# EAGLE design SWITCHCONTROL (EAGLE 8.4.1)

## Sheet 1 of 4
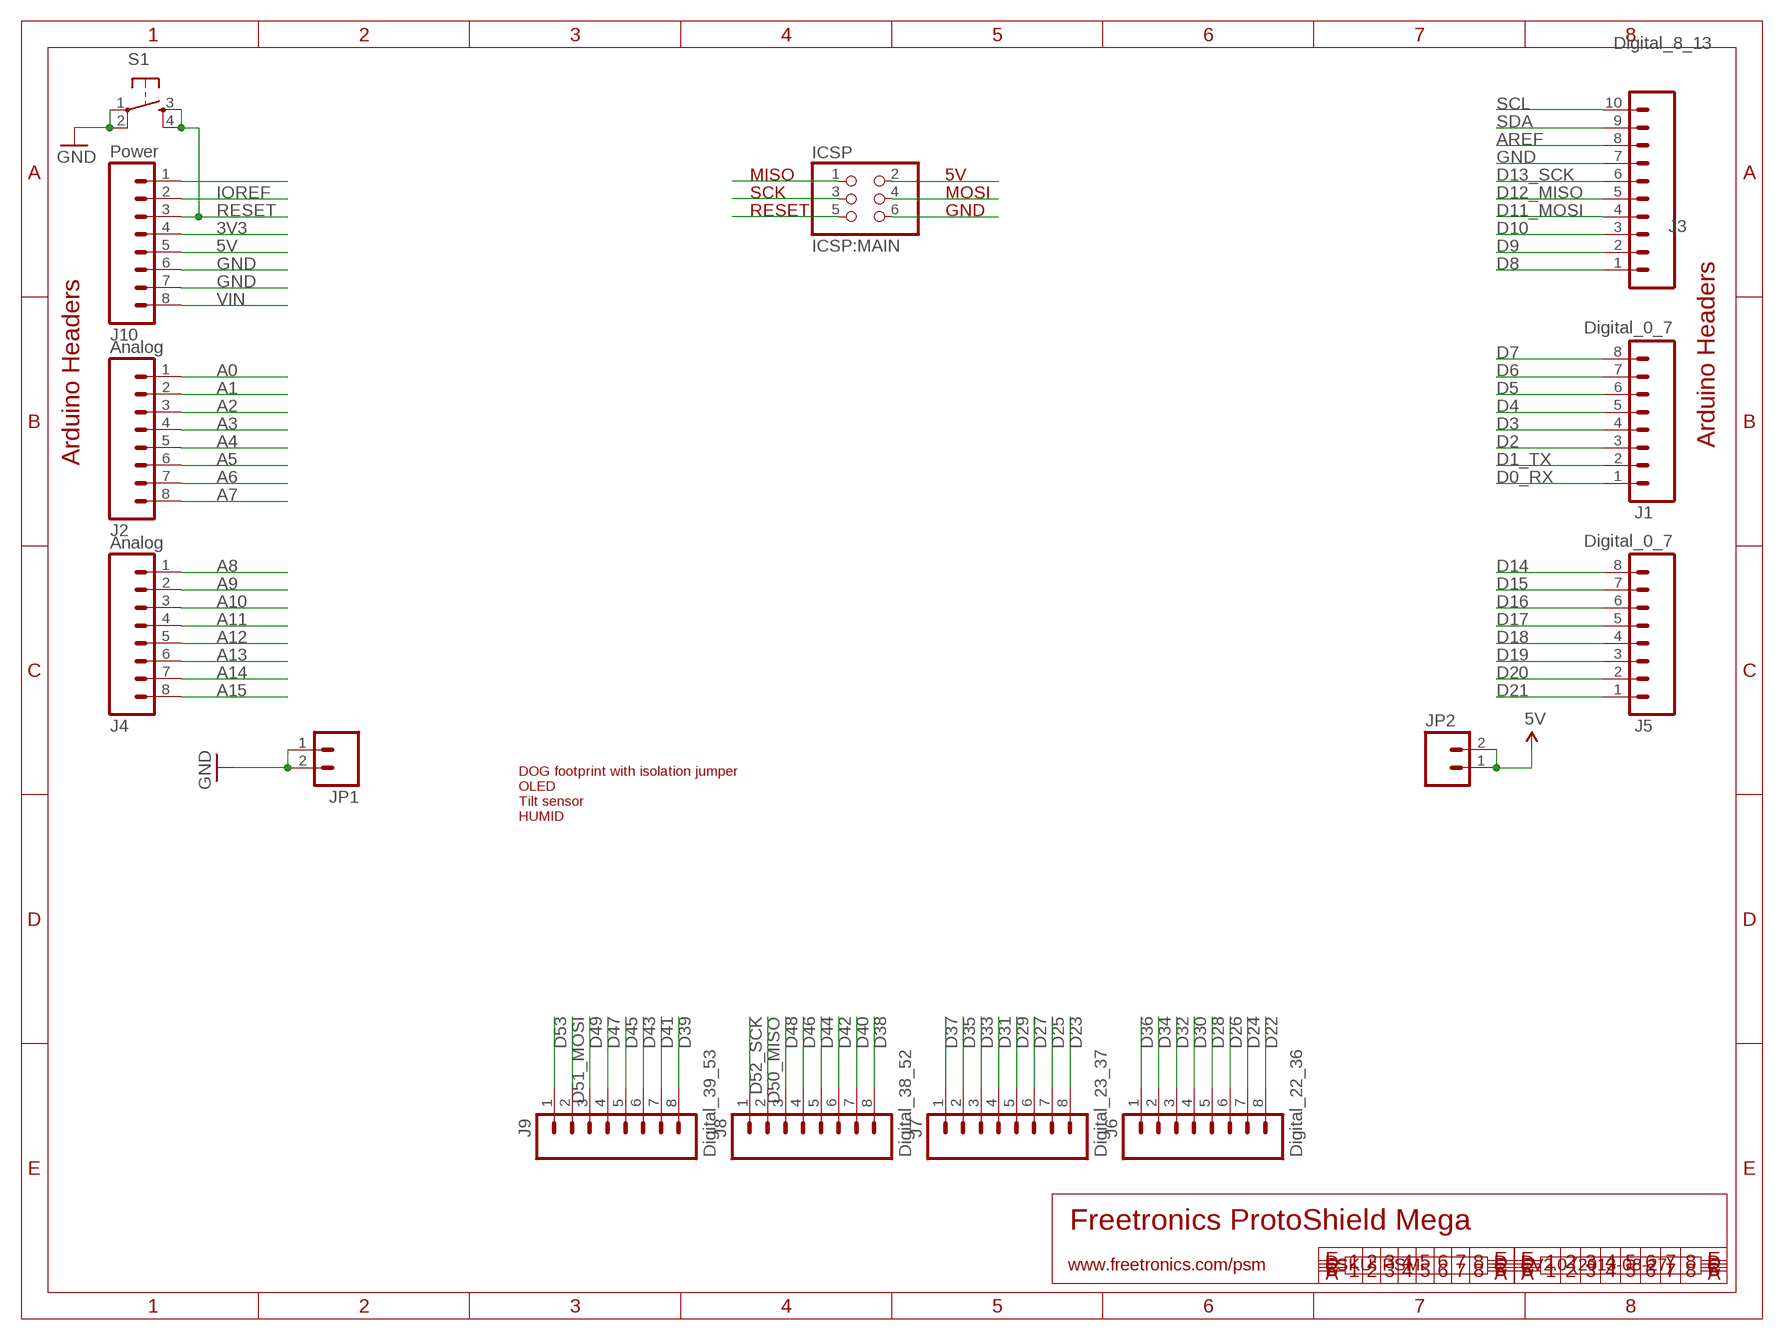
[diagram p0: schematic, sheet 1]

### Parts
ICSP  ICSP:MAIN  PINHD-2X3  [2X03]
J1  Digital_0_7  M08  [1X08]
J2  Analog  M08  [1X08]
J3  Digital_8_13  M100.1  [1X10]
J4  Analog  M08  [1X08]
J5  Digital_0_7  M08  [1X08]
J6  Digital_22_36  M08  [1X08]
J7  Digital_23_37  M08  [1X08]
J8  Digital_38_52  M08  [1X08]
J9  Digital_39_53  M08  [1X08]
J10  Power  M08  [1X08]
JP1  M02PTH  [1X02]
JP2  M02PTH  [1X02]
S1  TAC_SWITCHPTH  [TACTILE-PTH]

### Nets
3V3: J10.4
5V: J10.5 JP2.1 JP2.2
A0: J2.1 ; also sheet 2
A1: J2.2 ; also sheet 2
A2: J2.3 ; also sheet 2
A3: J2.4 ; also sheet 2
A4: J2.5 ; also sheet 2
A5: J2.6 ; also sheet 2
A6: J2.7 ; also sheet 2
A7: J2.8 ; also sheet 2
A8: J4.1 ; also sheet 2
A9: J4.2 ; also sheet 2
A10: J4.3 ; also sheet 2
A11: J4.4 ; also sheet 2
A12: J4.5 ; also sheet 2
A13: J4.6 ; also sheet 2
A14: J4.7 ; also sheet 2
A15: J4.8 ; also sheet 2
AREF: J3.8
D0_RX: J1.1
D1_TX: J1.2
D2: J1.3
D3: J1.4
D4: J1.5
D5: J1.6
D6: J1.7
D7: J1.8
D8: J3.1
D9: J3.2
D10: J3.3
D11_MOSI: J3.4
D12_MISO: J3.5
D13_SCK: J3.6
D14: J5.8
D15: J5.7
D16: J5.6 ; also sheet 3
D17: J5.5 ; also sheet 3
D18: J5.4 ; also sheet 3
D19: J5.3 ; also sheet 3
D20: J5.2 ; also sheet 3
D21: J5.1 ; also sheet 3
D22: J6.8 ; also sheet 3
D23: J7.8 ; also sheet 3
D24: J6.7 ; also sheet 4
D25: J7.7 ; also sheet 4
D26: J6.6 ; also sheet 4
D27: J7.6 ; also sheet 4
D28: J6.5 ; also sheet 4
D29: J7.5 ; also sheet 4
D30: J6.4 ; also sheet 4
D31: J7.4 ; also sheet 4
D32: J6.3 ; also sheet 4
D33: J7.3 ; also sheet 4
D34: J6.2 ; also sheet 4
D35: J7.2 ; also sheet 4
D36: J6.1 ; also sheet 4
D37: J7.1 ; also sheet 4
D38: J8.8 ; also sheet 4
D39: J9.8 ; also sheet 4
D40: J8.7 ; also sheet 3
D41: J9.7 ; also sheet 3
D42: J8.6 ; also sheet 3
D43: J9.6 ; also sheet 3
D44: J8.5 ; also sheet 3
D45: J9.5 ; also sheet 3
D46: J8.4 ; also sheet 3
D47: J9.4 ; also sheet 3
D48: J8.3
D49: J9.3
D50_MISO: J8.2
D51_MOSI: J9.2
D52_SCK: J8.1
D53: J9.1
GND: J3.7 J10.6 J10.7 JP1.1 JP1.2 S1.1 S1.2 ; also sheet 2,3,4
IOREF: J10.2
N$186: ICSP.1
N$187: ICSP.3
N$188: ICSP.5
N$197: ICSP.2
N$198: ICSP.4
N$199: ICSP.6
N$314: J10.1
RESET: J10.3 S1.3 S1.4
SCL: J3.10
SDA: J3.9
VIN: J10.8 ; also sheet 2,3,4

### Notes on the sheet
- MISO | 5V
- SCK | MOSI
- RESET | GND
- Arduino Headers
- Arduino Headers
- DOG footprint with isolation jumper
  OLED
  Tilt sensor
  HUMID
- Freetronics ProtoShield Mega
- www.freetronics.com/psm | SKU: PSM | V2.0 (2013-08-27)

## Sheet 2 of 4
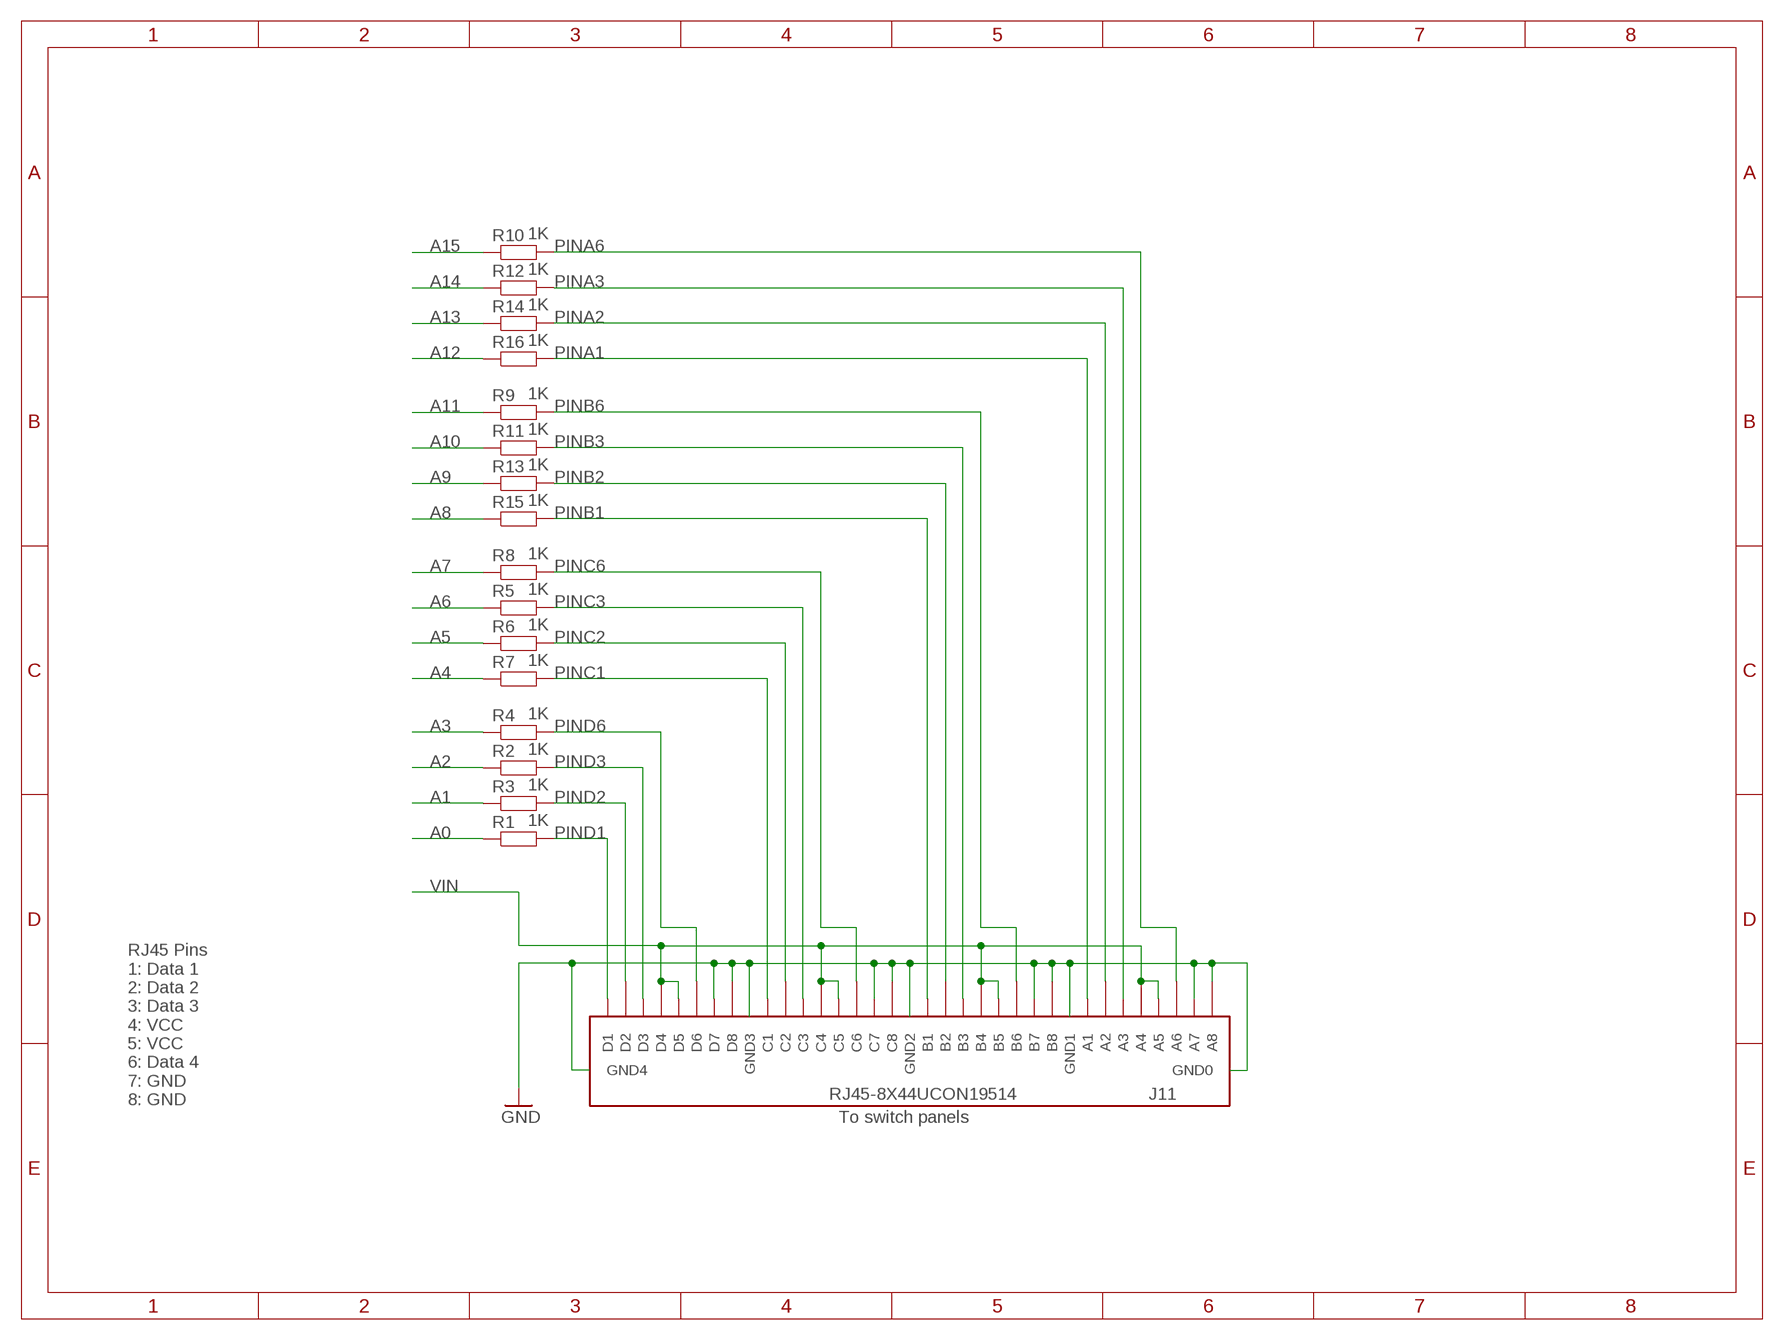
[diagram p1: schematic, sheet 2]

### Parts
J11  RJ45-8X44UCON19514  [RJ45-8X4]
R1  1K  RESISTOR0603  [0603]
R2  1K  RESISTOR0603  [0603]
R3  1K  RESISTOR0603  [0603]
R4  1K  RESISTOR0603  [0603]
R5  1K  RESISTOR0603  [0603]
R6  1K  RESISTOR0603  [0603]
R7  1K  RESISTOR0603  [0603]
R8  1K  RESISTOR0603  [0603]
R9  1K  RESISTOR0603  [0603]
R10  1K  RESISTOR0603  [0603]
R11  1K  RESISTOR0603  [0603]
R12  1K  RESISTOR0603  [0603]
R13  1K  RESISTOR0603  [0603]
R14  1K  RESISTOR0603  [0603]
R15  1K  RESISTOR0603  [0603]
R16  1K  RESISTOR0603  [0603]

### Nets
A0: R1.1 ; also sheet 1
A1: R3.1 ; also sheet 1
A2: R2.1 ; also sheet 1
A3: R4.1 ; also sheet 1
A4: R7.1 ; also sheet 1
A5: R6.1 ; also sheet 1
A6: R5.1 ; also sheet 1
A7: R8.1 ; also sheet 1
A8: R15.1 ; also sheet 1
A9: R13.1 ; also sheet 1
A10: R11.1 ; also sheet 1
A11: R9.1 ; also sheet 1
A12: R16.1 ; also sheet 1
A13: R14.1 ; also sheet 1
A14: R12.1 ; also sheet 1
A15: R10.1 ; also sheet 1
GND: J11.A7 J11.A8 J11.B7 J11.B8 J11.C7 J11.C8 J11.D7 J11.D8 J11.GND0 J11.GND1 J11.GND2 J11.GND3 J11.GND4 ; also sheet 1,3,4
PINA1: J11.A1 R16.2
PINA2: J11.A2 R14.2
PINA3: J11.A3 R12.2
PINA6: J11.A6 R10.2
PINB1: J11.B1 R15.2
PINB2: J11.B2 R13.2
PINB3: J11.B3 R11.2
PINB6: J11.B6 R9.2
PINC1: J11.C1 R7.2
PINC2: J11.C2 R6.2
PINC3: J11.C3 R5.2
PINC6: J11.C6 R8.2
PIND1: J11.D1 R1.2
PIND2: J11.D2 R3.2
PIND3: J11.D3 R2.2
PIND6: J11.D6 R4.2
VIN: J11.A4 J11.A5 J11.B4 J11.B5 J11.C4 J11.C5 J11.D4 J11.D5 ; also sheet 1,3,4

### Notes on the sheet
- RJ45 Pins
  1: Data 1
  2: Data 2
  3: Data 3
  4: VCC
  5: VCC
  6: Data 4
  7: GND
  8: GND
- To switch panels

## Sheet 3 of 4
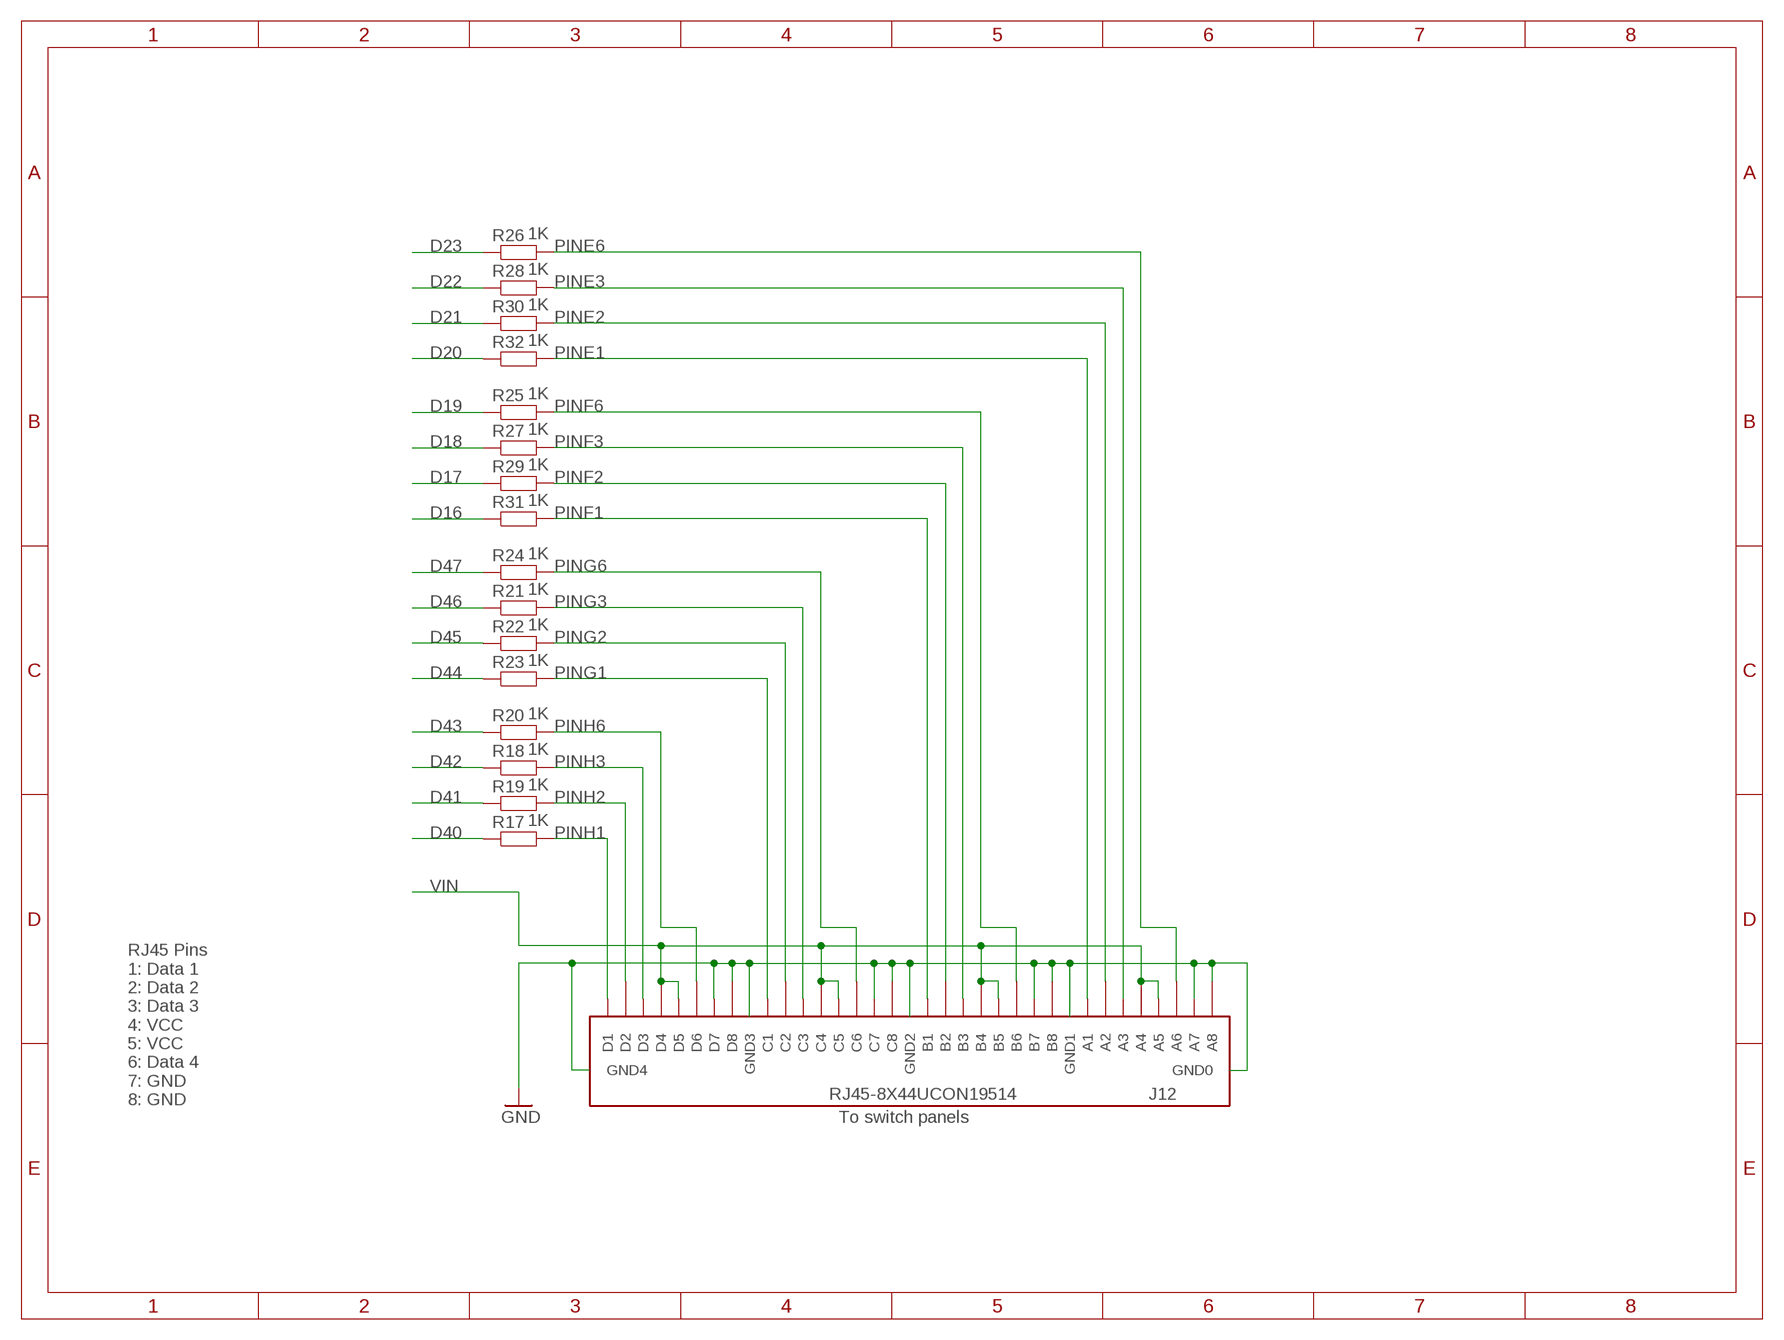
[diagram p2: schematic, sheet 3]

### Parts
J12  RJ45-8X44UCON19514  [RJ45-8X4]
R17  1K  RESISTOR0603  [0603]
R18  1K  RESISTOR0603  [0603]
R19  1K  RESISTOR0603  [0603]
R20  1K  RESISTOR0603  [0603]
R21  1K  RESISTOR0603  [0603]
R22  1K  RESISTOR0603  [0603]
R23  1K  RESISTOR0603  [0603]
R24  1K  RESISTOR0603  [0603]
R25  1K  RESISTOR0603  [0603]
R26  1K  RESISTOR0603  [0603]
R27  1K  RESISTOR0603  [0603]
R28  1K  RESISTOR0603  [0603]
R29  1K  RESISTOR0603  [0603]
R30  1K  RESISTOR0603  [0603]
R31  1K  RESISTOR0603  [0603]
R32  1K  RESISTOR0603  [0603]

### Nets
D16: R31.1 ; also sheet 1
D17: R29.1 ; also sheet 1
D18: R27.1 ; also sheet 1
D19: R25.1 ; also sheet 1
D20: R32.1 ; also sheet 1
D21: R30.1 ; also sheet 1
D22: R28.1 ; also sheet 1
D23: R26.1 ; also sheet 1
D40: R17.1 ; also sheet 1
D41: R19.1 ; also sheet 1
D42: R18.1 ; also sheet 1
D43: R20.1 ; also sheet 1
D44: R23.1 ; also sheet 1
D45: R22.1 ; also sheet 1
D46: R21.1 ; also sheet 1
D47: R24.1 ; also sheet 1
GND: J12.A7 J12.A8 J12.B7 J12.B8 J12.C7 J12.C8 J12.D7 J12.D8 J12.GND0 J12.GND1 J12.GND2 J12.GND3 J12.GND4 ; also sheet 1,2,4
PINE1: J12.A1 R32.2
PINE2: J12.A2 R30.2
PINE3: J12.A3 R28.2
PINE6: J12.A6 R26.2
PINF1: J12.B1 R31.2
PINF2: J12.B2 R29.2
PINF3: J12.B3 R27.2
PINF6: J12.B6 R25.2
PING1: J12.C1 R23.2
PING2: J12.C2 R22.2
PING3: J12.C3 R21.2
PING6: J12.C6 R24.2
PINH1: J12.D1 R17.2
PINH2: J12.D2 R19.2
PINH3: J12.D3 R18.2
PINH6: J12.D6 R20.2
VIN: J12.A4 J12.A5 J12.B4 J12.B5 J12.C4 J12.C5 J12.D4 J12.D5 ; also sheet 1,2,4

### Notes on the sheet
- RJ45 Pins
  1: Data 1
  2: Data 2
  3: Data 3
  4: VCC
  5: VCC
  6: Data 4
  7: GND
  8: GND
- To switch panels

## Sheet 4 of 4
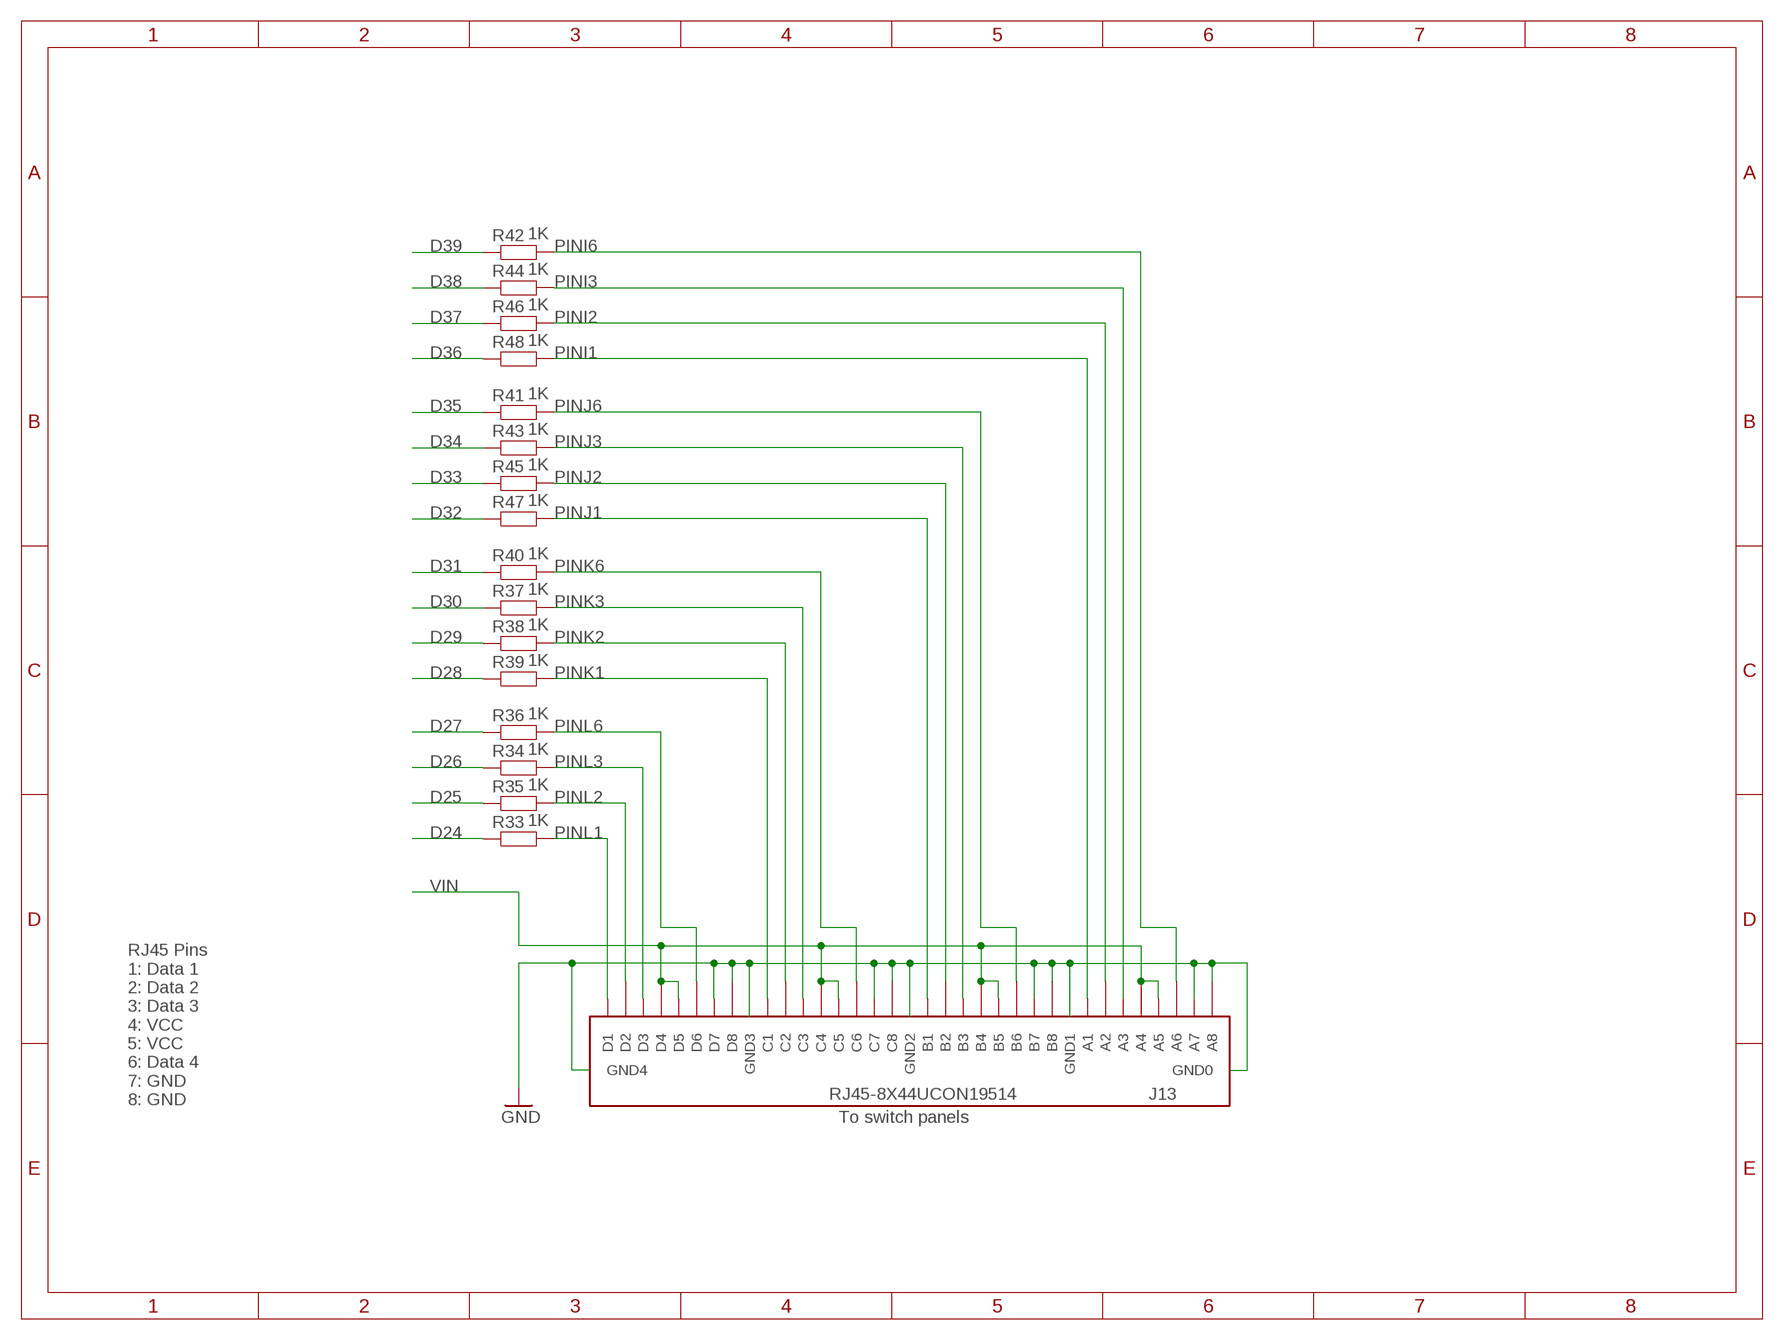
[diagram p3: schematic, sheet 4]

### Parts
J13  RJ45-8X44UCON19514  [RJ45-8X4]
R33  1K  RESISTOR0603  [0603]
R34  1K  RESISTOR0603  [0603]
R35  1K  RESISTOR0603  [0603]
R36  1K  RESISTOR0603  [0603]
R37  1K  RESISTOR0603  [0603]
R38  1K  RESISTOR0603  [0603]
R39  1K  RESISTOR0603  [0603]
R40  1K  RESISTOR0603  [0603]
R41  1K  RESISTOR0603  [0603]
R42  1K  RESISTOR0603  [0603]
R43  1K  RESISTOR0603  [0603]
R44  1K  RESISTOR0603  [0603]
R45  1K  RESISTOR0603  [0603]
R46  1K  RESISTOR0603  [0603]
R47  1K  RESISTOR0603  [0603]
R48  1K  RESISTOR0603  [0603]

### Nets
D24: R33.1 ; also sheet 1
D25: R35.1 ; also sheet 1
D26: R34.1 ; also sheet 1
D27: R36.1 ; also sheet 1
D28: R39.1 ; also sheet 1
D29: R38.1 ; also sheet 1
D30: R37.1 ; also sheet 1
D31: R40.1 ; also sheet 1
D32: R47.1 ; also sheet 1
D33: R45.1 ; also sheet 1
D34: R43.1 ; also sheet 1
D35: R41.1 ; also sheet 1
D36: R48.1 ; also sheet 1
D37: R46.1 ; also sheet 1
D38: R44.1 ; also sheet 1
D39: R42.1 ; also sheet 1
GND: J13.A7 J13.A8 J13.B7 J13.B8 J13.C7 J13.C8 J13.D7 J13.D8 J13.GND0 J13.GND1 J13.GND2 J13.GND3 J13.GND4 ; also sheet 1,2,3
PINI1: J13.A1 R48.2
PINI2: J13.A2 R46.2
PINI3: J13.A3 R44.2
PINI6: J13.A6 R42.2
PINJ1: J13.B1 R47.2
PINJ2: J13.B2 R45.2
PINJ3: J13.B3 R43.2
PINJ6: J13.B6 R41.2
PINK1: J13.C1 R39.2
PINK2: J13.C2 R38.2
PINK3: J13.C3 R37.2
PINK6: J13.C6 R40.2
PINL1: J13.D1 R33.2
PINL2: J13.D2 R35.2
PINL3: J13.D3 R34.2
PINL6: J13.D6 R36.2
VIN: J13.A4 J13.A5 J13.B4 J13.B5 J13.C4 J13.C5 J13.D4 J13.D5 ; also sheet 1,2,3

### Notes on the sheet
- RJ45 Pins
  1: Data 1
  2: Data 2
  3: Data 3
  4: VCC
  5: VCC
  6: Data 4
  7: GND
  8: GND
- To switch panels

## Library data of the parts
ICSP = pinhead:PINHD-2X3: PIN HEADER
J1 J5-J9 = freetronics:M08: Header 8 Standard 8-pin 0.1" header. Use with straight break away headers (SKU : PRT-00116), right angle break away headers (PRT-00553), swiss pins (PRT-00743), machine pins (PRT-00117), and female headers (PRT-00115).
J2 J4 J10 = freetronics-master-v1:M08: Header 8 Standard 8-pin 0.1" header. Use with straight break away headers (SKU : PRT-00116), right angle break away headers (PRT-00553), swiss pins (PRT-00743), machine pins (PRT-00117), and female headers (PRT-00115).
J3 = freetronics-original:M10: Header 10 Standard 10-pin 0.1" header. Use with straight break away headers (SKU : PRT-00116), right angle break away headers (PRT-00553), swiss pins (PRT-00743), machine pins (PRT-00117), and female headers (PRT-00115).
J11-J13 = freetronics-jon:RJ45-8X4
JP1 JP2 = freetronics-master-v1:M02: Header 2 Standard 2-pin 0.1" header. Use with straight break away headers (SKU : PRT-00116), right angle break away headers (PRT-00553), swiss pins (PRT-00743), machine pins (PRT-00117), and female headers (PRT-00115). Molex polarized connector foot print use with SKU : PRT-08233 with associated crimp pins and housings.
R1-R48 = freetronics-jon:RESISTOR: Resistor Basic schematic elements and footprints for 0603, 1206, and PTH 1/10th watt (small) resistors.
S1 = freetronics-master-v1:TAC_SWITCH: Momentary Switch Button commonly used for reset or general input. Spark Fun Electronics SKU : COM-00097

## Board
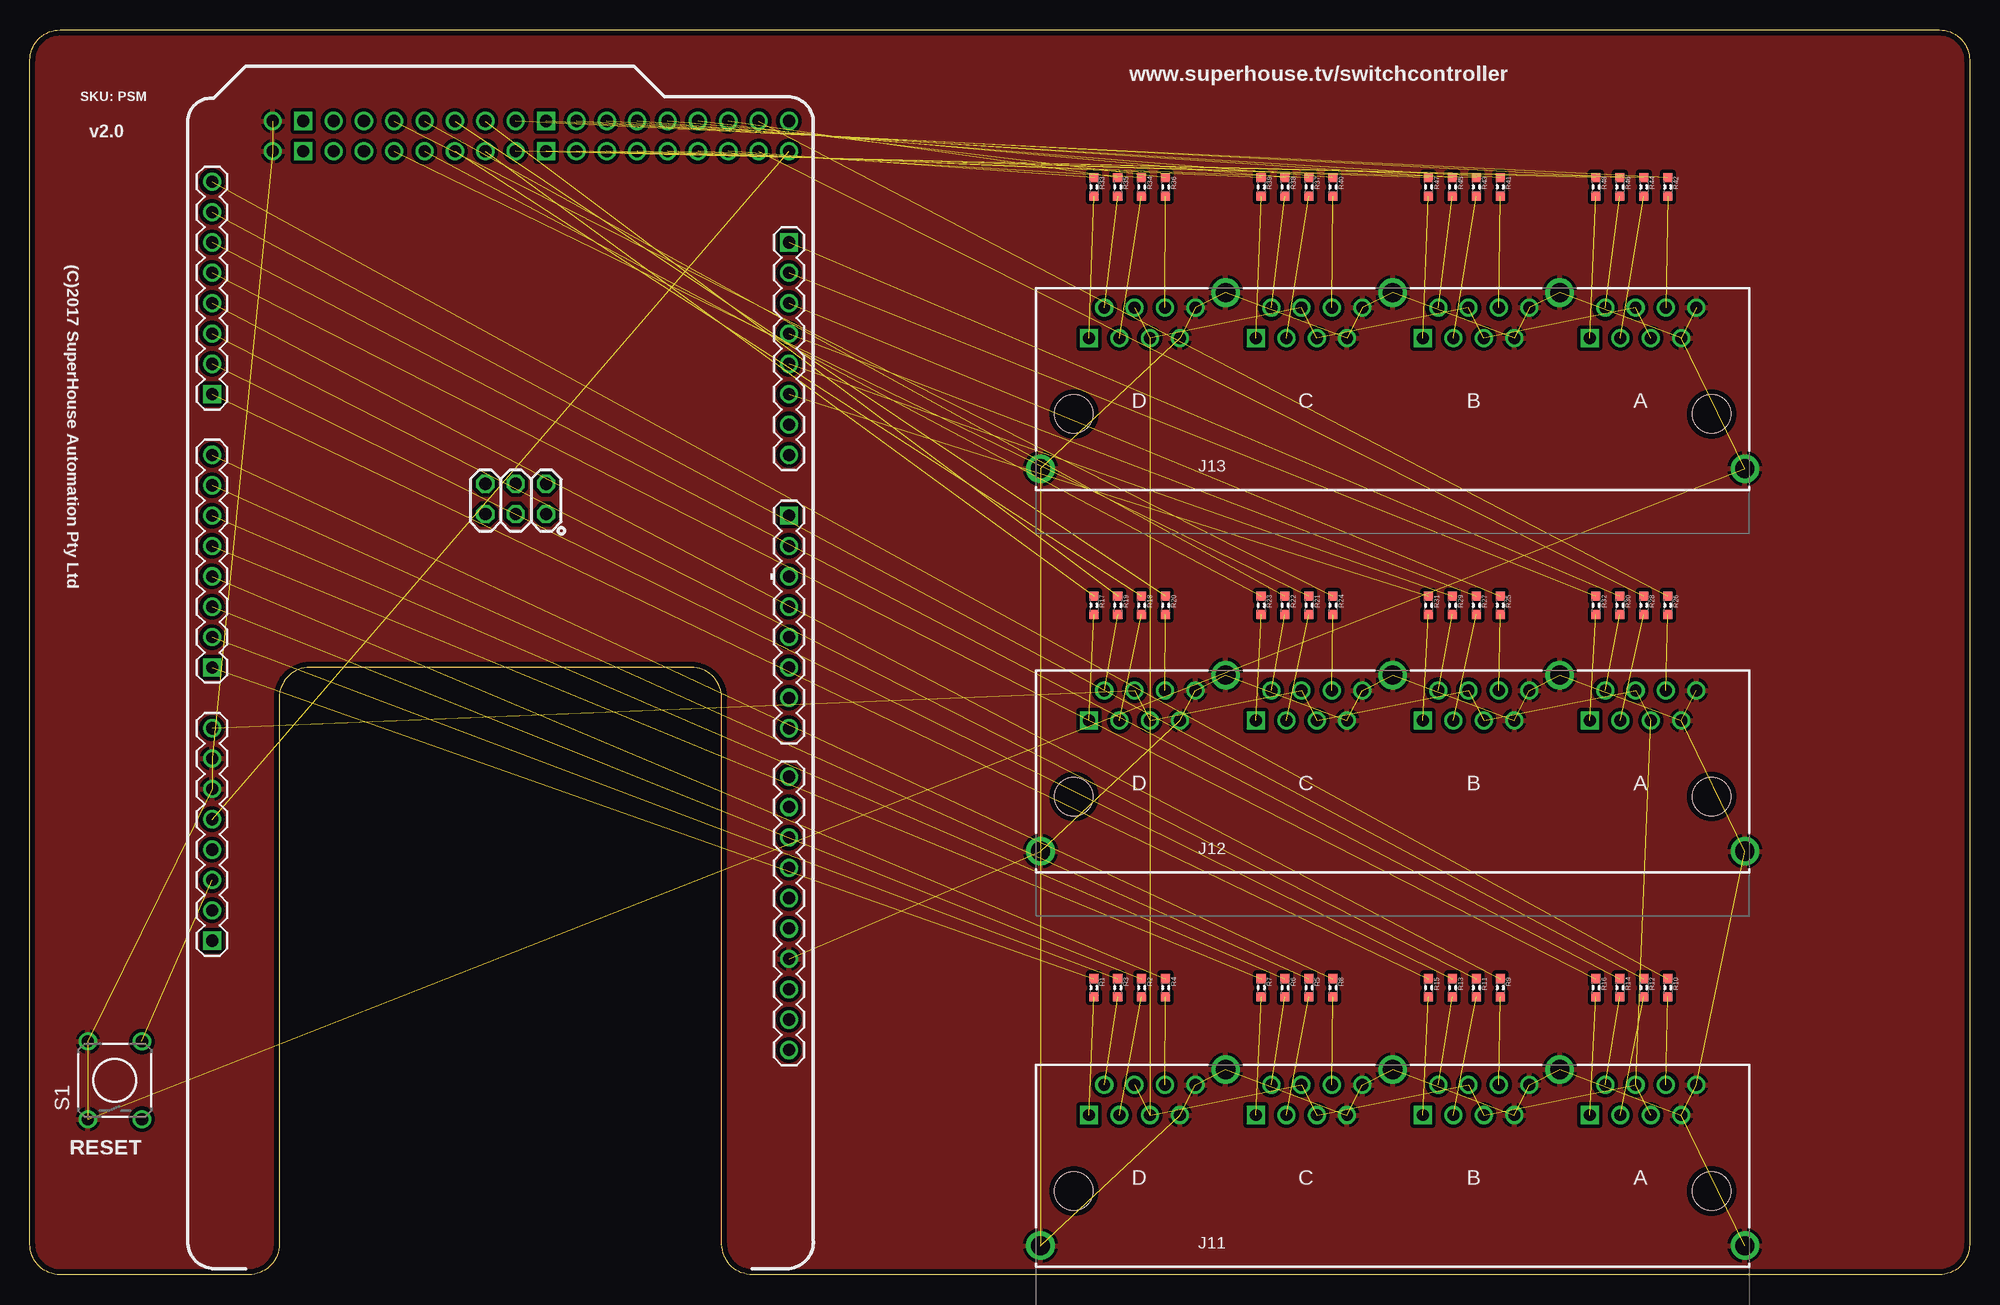
[diagram p4: board, top side]
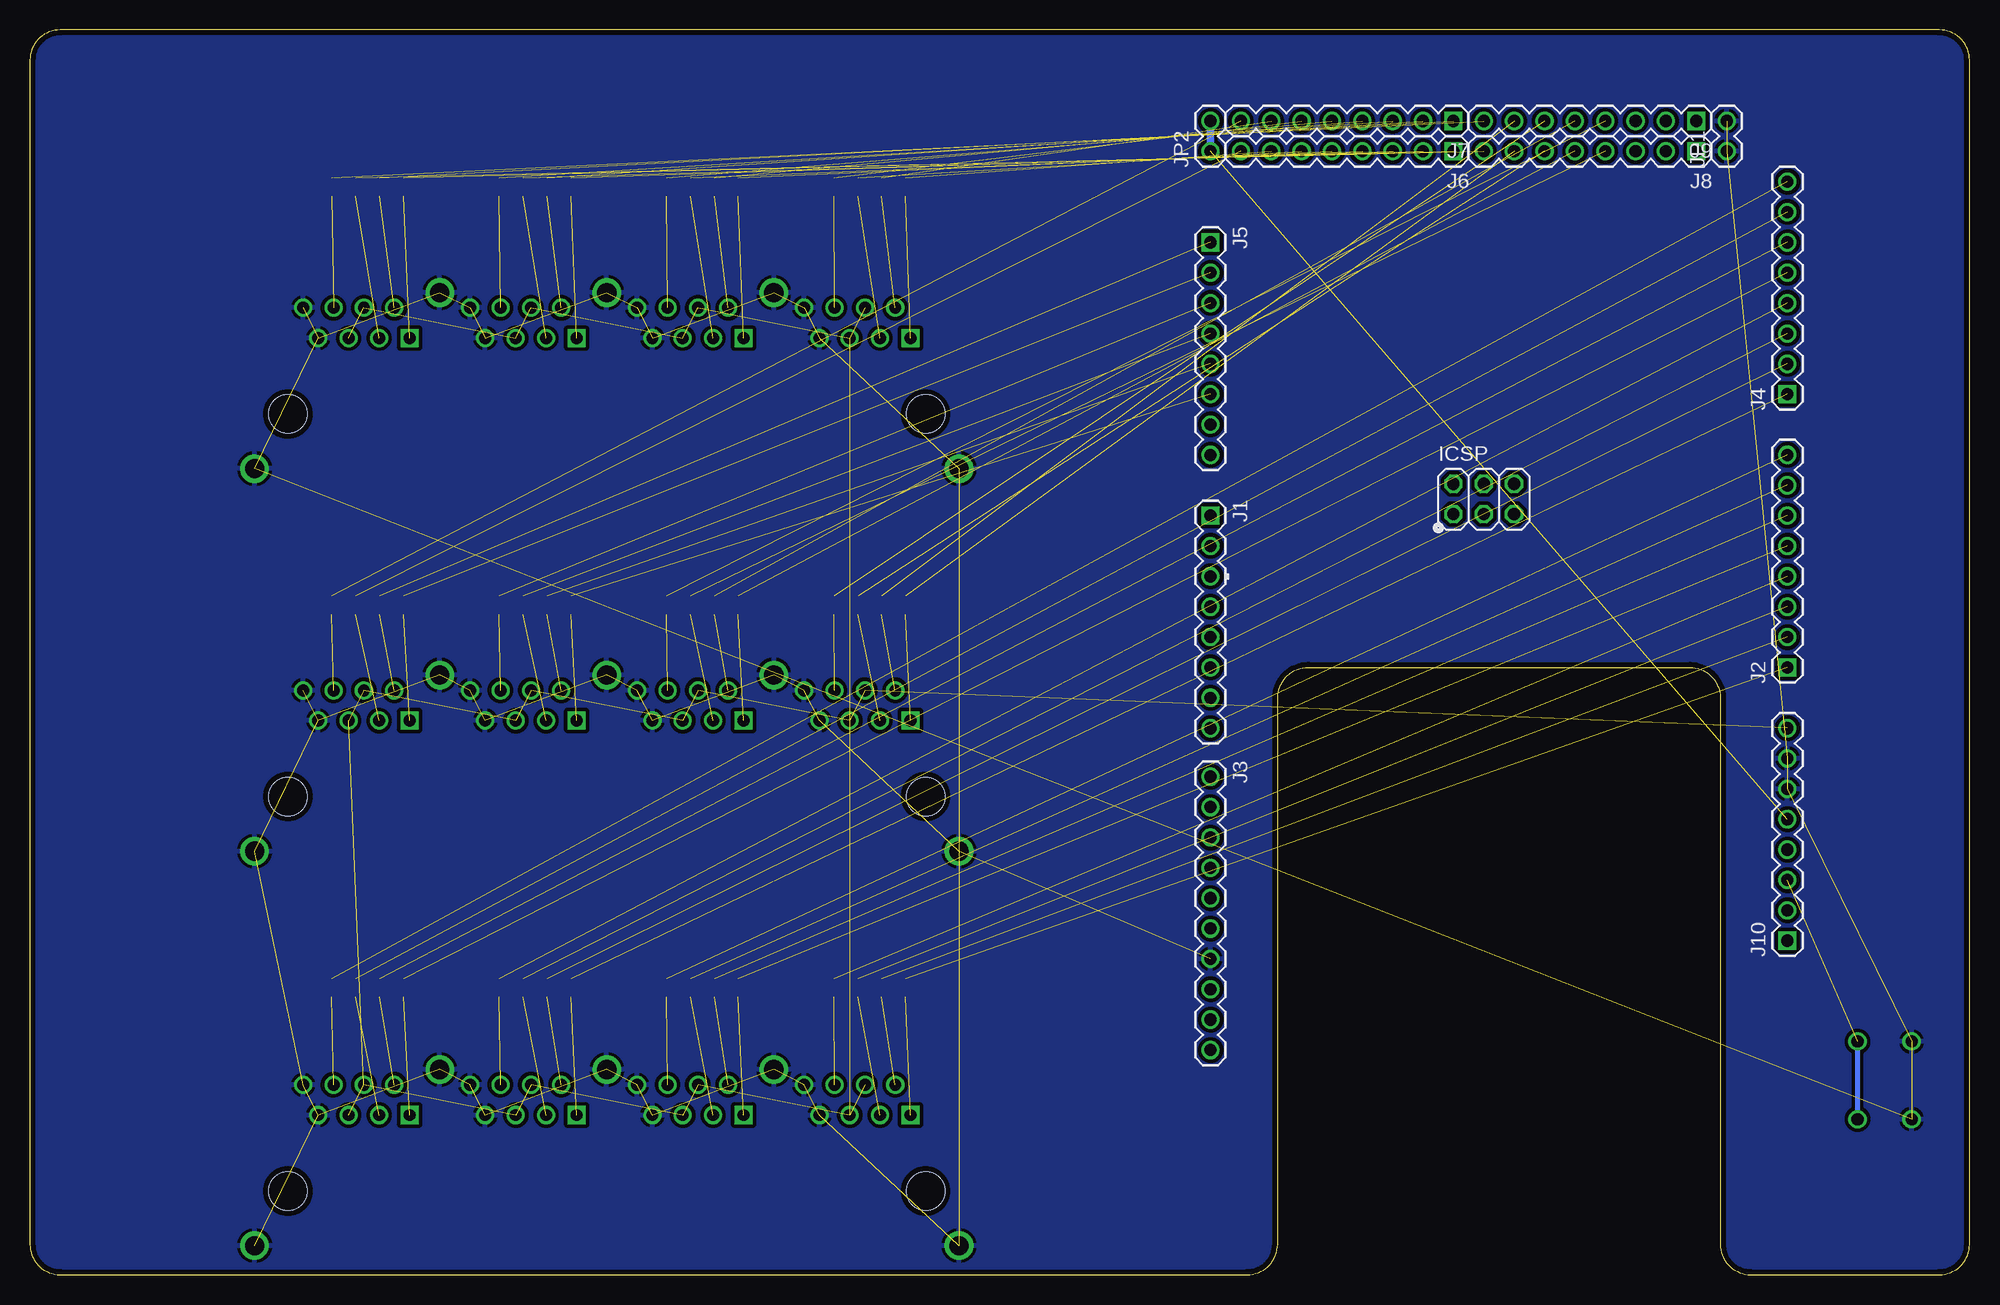
[diagram p5: board, bottom side, seen from below]

Size 162.26 x 104.14 mm. Coordinates in mm from the lower left corner, seen from the top.
Outline: 2.54,0 arc-90 0,2.54 0,101.6 arc-90 2.54,104.14 159.72,104.14 arc-90 162.26,101.6 162.26,2.54 arc-90 159.72,0 60.42,0 arc-90 57.88,2.54 57.88,48.26 arc90 55.34,50.8 23.4,50.8 arc90 20.86,48.26 20.86,2.54 arc-90 18.32,0 2.54,0
Copper layers (1*16): Top 0.035mm / dielectric 1.5mm / Bottom 0.035mm
Design rules "default *": minimum track width 10mil, minimum drill 24mil, track to track 12mil, track to pad 12mil, pad to pad 12mil, via to via 12mil, smd to smd 8mil, copper to edge 18mil, drill to drill 8mil, minimum pad ring 10mil, minimum via ring 8mil, stop-mask expansion 4mil, vias tented up to drill 0mil, thermal gap 10mil

### Footprints (pad centres in the part's own frame; a part is rotated, then mirrored left to right if it is on the bottom)
2X03 = drill 1.016 octagon: 1 -2.54,-1.27; 2 -2.54,1.27; 3 0,-1.27; 4 0,1.27; 5 2.54,-1.27; 6 2.54,1.27
1X08 = drill 1.016 square: 1 0,0 | drill 1.016: 2 2.54,0; 3 5.08,0; 4 7.62,0; 5 10.16,0; 6 12.7,0; 7 15.24,0; 8 17.78,0
1X10 = drill 1.016: 1 0,0; 2 2.54,0; 3 5.08,0; 4 7.62,0; 5 10.16,0; 6 12.7,0; 7 15.24,0; 8 17.78,0; 9 20.32,0; 10 22.86,0
RJ45-8X4 = drill 1 square: A1 -16.51,-6.35; B1 -2.54,-6.35; C1 11.43,-6.35; D1 25.4,-6.35 | drill 1: A2 -17.78,-8.89; A3 -19.05,-6.35; A4 -20.32,-8.89; A5 -21.59,-6.35; A6 -22.86,-8.89; A7 -24.13,-6.35; A8 -25.4,-8.89; B2 -3.81,-8.89; B3 -5.08,-6.35; B4 -6.35,-8.89; B5 -7.62,-6.35; B6 -8.89,-8.89; B7 -10.16,-6.35; B8 -11.43,-8.89; C2 10.16,-8.89; C3 8.89,-6.35; C4 7.62,-8.89; C5 6.35,-6.35; C6 5.08,-8.89; C7 3.81,-6.35; C8 2.54,-8.89; D2 24.13,-8.89; D3 22.86,-6.35; D4 21.59,-8.89; D5 20.32,-6.35; D6 19.05,-8.89; D7 17.78,-6.35; D8 16.51,-8.89 | drill 1.6: GND0 -29.464,4.572; GND1 -13.97,-10.16; GND2 0,-10.16; GND3 13.97,-10.16; GND4 29.464,4.572 | hole 3.2: -26.67,0; 26.67,0
1X02 = drill 1.016: 1 0,0; 2 2.54,0
0603 = smd 0.762 x 0.762: 1 -0.762,0; 2 0.762,0
TACTILE-PTH = drill 1.016: 1 -3.251,2.261; 2 3.251,2.261; 3 -3.251,-2.261; 4 3.251,-2.261

### Placement (x,y rotation side)
ICSP  40.64,64.9 0 bottom
J1  63.5,63.5 270 bottom
J2  15.24,50.8 90 bottom
J3  63.5,41.66 270 bottom
J4  15.24,73.66 90 bottom
J5  63.5,86.36 270 bottom
J6  43.18,93.98 180 bottom
J7  43.18,96.52 180 bottom
J8  22.86,93.98 180 bottom
J9  22.86,96.52 180 bottom
J10  15.24,27.94 90 bottom
J11  114,7 180 top
J12  114,40 180 top
J13  114,72 180 top
JP1  20.32,93.98 90 bottom
JP2  63.5,93.98 90 bottom
R1  89,24 270 top
R2  93,24 270 top
R3  91,24 270 top
R4  95,24 270 top
R5  107,24 270 top
R6  105,24 270 top
R7  103,24 270 top
R8  109,24 270 top
R9  123,24 270 top
R10  137,24 270 top
R11  121,24 270 top
R12  135,24 270 top
R13  119,24 270 top
R14  133,24 270 top
R15  117,24 270 top
R16  131,24 270 top
R17  89,56 270 top
R18  93,56 270 top
R19  91,56 270 top
R20  95,56 270 top
R21  107,56 270 top
R22  105,56 270 top
R23  103,56 270 top
R24  109,56 270 top
R25  123,56 270 top
R26  137,56 270 top
R27  121,56 270 top
R28  135,56 270 top
R29  119,56 270 top
R30  133,56 270 top
R31  117,56 270 top
R32  131,56 270 top
R33  89,91 270 top
R34  93,91 270 top
R35  91,91 270 top
R36  95,91 270 top
R37  107,91 270 top
R38  105,91 270 top
R39  103,91 270 top
R40  109,91 270 top
R41  123,91 270 top
R42  137,91 270 top
R43  121,91 270 top
R44  135,91 270 top
R45  119,91 270 top
R46  133,91 270 top
R47  117,91 270 top
R48  131,91 270 top
S1  7.11,16.26 90 top

### Tracks (layer width: path | path; a pad name or v marks a point on that pad's centre or on a via)
5V  (1 unrouted)
  Bottom 0.61: JP2.1 JP2.2
A0  (1 unrouted)
A1  (1 unrouted)
A2  (1 unrouted)
A3  (1 unrouted)
A4  (1 unrouted)
A5  (1 unrouted)
A6  (1 unrouted)
A7  (1 unrouted)
A8  (1 unrouted)
A9  (1 unrouted)
A10  (1 unrouted)
A11  (1 unrouted)
A12  (1 unrouted)
A13  (1 unrouted)
A14  (1 unrouted)
A15  (1 unrouted)
D16  (1 unrouted)
D17  (1 unrouted)
D18  (1 unrouted)
D19  (1 unrouted)
D20  (1 unrouted)
D21  (1 unrouted)
D22  (1 unrouted)
D23  (1 unrouted)
D24  (1 unrouted)
D25  (1 unrouted)
D26  (1 unrouted)
D27  (1 unrouted)
D28  (1 unrouted)
D29  (1 unrouted)
D30  (1 unrouted)
D31  (1 unrouted)
D32  (1 unrouted)
D33  (1 unrouted)
D34  (1 unrouted)
D35  (1 unrouted)
D36  (1 unrouted)
D37  (1 unrouted)
D38  (1 unrouted)
D39  (1 unrouted)
D40  (1 unrouted)
D41  (1 unrouted)
D42  (1 unrouted)
D43  (1 unrouted)
D44  (1 unrouted)
D45  (1 unrouted)
D46  (1 unrouted)
D47  (1 unrouted)
GND  (45 unrouted)
  pour Top: 159.72,0 arc74 162.26,2.54 162.26,101.6 arc74 159.72,104.14 2.54,104.14 arc74 0,101.6 0,1.27 arc74 2.54,0 18.32,0 arc90 20.86,2.54 20.86,48.26 arc-90 23.4,50.8 55.34,50.8 arc-90 57.88,48.26 57.88,2.54 arc90 60.42,0
  pour Bottom: 159.72,0 arc74 162.26,2.54 162.26,101.6 arc74 159.72,104.14 2.54,104.14 arc74 0,101.6 0,1.27 arc74 2.54,0 18.32,0 arc90 20.86,2.54 20.86,48.26 arc-90 23.4,50.8 55.34,50.8 arc-90 57.88,48.26 57.88,2.54 arc90 60.42,0
PINA1  (1 unrouted)
PINA2  (1 unrouted)
PINA3  (1 unrouted)
PINA6  (1 unrouted)
PINB1  (1 unrouted)
PINB2  (1 unrouted)
PINB3  (1 unrouted)
PINB6  (1 unrouted)
PINC1  (1 unrouted)
PINC2  (1 unrouted)
PINC3  (1 unrouted)
PINC6  (1 unrouted)
PIND1  (1 unrouted)
PIND2  (1 unrouted)
PIND3  (1 unrouted)
PIND6  (1 unrouted)
PINE1  (1 unrouted)
PINE2  (1 unrouted)
PINE3  (1 unrouted)
PINE6  (1 unrouted)
PINF1  (1 unrouted)
PINF2  (1 unrouted)
PINF3  (1 unrouted)
PINF6  (1 unrouted)
PING1  (1 unrouted)
PING2  (1 unrouted)
PING3  (1 unrouted)
PING6  (1 unrouted)
PINH1  (1 unrouted)
PINH2  (1 unrouted)
PINH3  (1 unrouted)
PINH6  (1 unrouted)
PINI1  (1 unrouted)
PINI2  (1 unrouted)
PINI3  (1 unrouted)
PINI6  (1 unrouted)
PINJ1  (1 unrouted)
PINJ2  (1 unrouted)
PINJ3  (1 unrouted)
PINJ6  (1 unrouted)
PINK1  (1 unrouted)
PINK2  (1 unrouted)
PINK3  (1 unrouted)
PINK6  (1 unrouted)
PINL1  (1 unrouted)
PINL2  (1 unrouted)
PINL3  (1 unrouted)
PINL6  (1 unrouted)
RESET  (1 unrouted)
  Bottom 0.406: S1.3 S1.4
VIN  (24 unrouted)

### Text on the board
tPlace: www.superhouse.tv/switchcontroller | SKU: PSM | v2.0 | (C)2017 SuperHouse Automation Pty Ltd | RESET